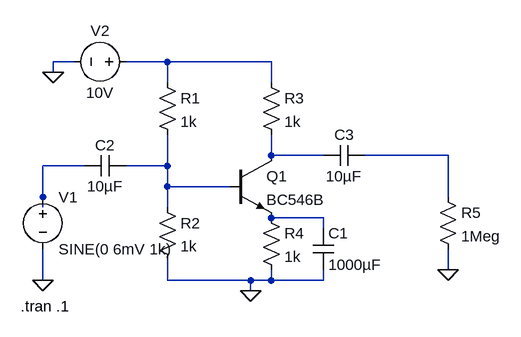
[diagram p0: schematic Tutorial_LTSpice_Ep4-BJT.asc]
Tutorial_LTSpice_Ep4-BJT.asc, the LTspice schematic file:
Version 4
SHEET 1 880 680
WIRE -64 -16 -96 -16
WIRE 80 -16 16 -16
WIRE 240 -16 80 -16
WIRE -96 0 -96 -16
WIRE 80 16 80 -16
WIRE 240 16 240 -16
WIRE 240 128 240 96
WIRE 320 128 240 128
WIRE 512 128 384 128
WIRE -48 144 -112 144
WIRE 80 144 80 96
WIRE 80 144 16 144
WIRE 80 176 80 144
WIRE 176 176 80 176
WIRE -112 192 -112 144
WIRE 512 192 512 128
WIRE -112 208 -112 192
WIRE 80 208 80 176
WIRE 320 224 240 224
WIRE 320 240 320 224
WIRE 512 304 512 272
WIRE -112 320 -112 272
WIRE 80 320 80 288
WIRE 208 320 80 320
WIRE 240 320 240 304
WIRE 240 320 208 320
WIRE 320 320 320 304
WIRE 320 320 240 320
WIRE 208 336 208 320
FLAG -96 0 0
FLAG 512 304 0
FLAG -112 320 0
FLAG 208 336 0
SYMBOL npn 176 128 R0
SYMATTR InstName Q1
SYMATTR Value BC546B
SYMBOL res 64 0 R0
SYMATTR InstName R1
SYMATTR Value 1k
SYMBOL res 64 192 R0
SYMATTR InstName R2
SYMATTR Value 1k
SYMBOL res 224 0 R0
SYMATTR InstName R3
SYMATTR Value 1k
SYMBOL res 224 208 R0
SYMATTR InstName R4
SYMATTR Value 1k
SYMBOL cap 304 240 R0
SYMATTR InstName C1
SYMATTR Value 1000µF
SYMBOL cap 16 128 R90
WINDOW 0 0 32 VBottom 2
WINDOW 3 32 32 VTop 2
SYMATTR InstName C2
SYMATTR Value 10µF
SYMBOL cap 384 112 R90
WINDOW 0 0 32 VBottom 2
WINDOW 3 32 32 VTop 2
SYMATTR InstName C3
SYMATTR Value 10µF
SYMBOL voltage -112 176 R0
WINDOW 123 0 0 Left 0
WINDOW 39 0 0 Left 0
SYMATTR InstName V1
SYMATTR Value SINE(0 6mV 1k)
SYMBOL voltage 32 -16 R90
WINDOW 0 -32 56 VBottom 2
WINDOW 3 32 56 VTop 2
WINDOW 123 0 0 Left 0
WINDOW 39 0 0 Left 0
SYMATTR InstName V2
SYMATTR Value 10V
SYMBOL res 496 176 R0
SYMATTR InstName R5
SYMATTR Value 1Meg
TEXT -146 360 Left 2 !.tran .1

The netlist it stands for:
* Tutorial_LTSpice_Ep4-BJT.asc
Q1 N002 N005 N006 0 BC546B
R1 N001 N005 1k
R2 N005 0 1k
R3 N001 N002 1k
R4 N006 0 1k
C1 N006 0 1000µF
C2 N005 N004 10µF
C3 N003 N002 10µF
V1 N004 0 SINE(0 6mV 1k)
V2 N001 0 10V
R5 N003 0 1Meg
.model NPN NPN
.model PNP PNP
.lib standard.bjt
.tran .1
.backanno
.end